# Altium schematic sheet MAXIM-ADC3.SchDoc
size B
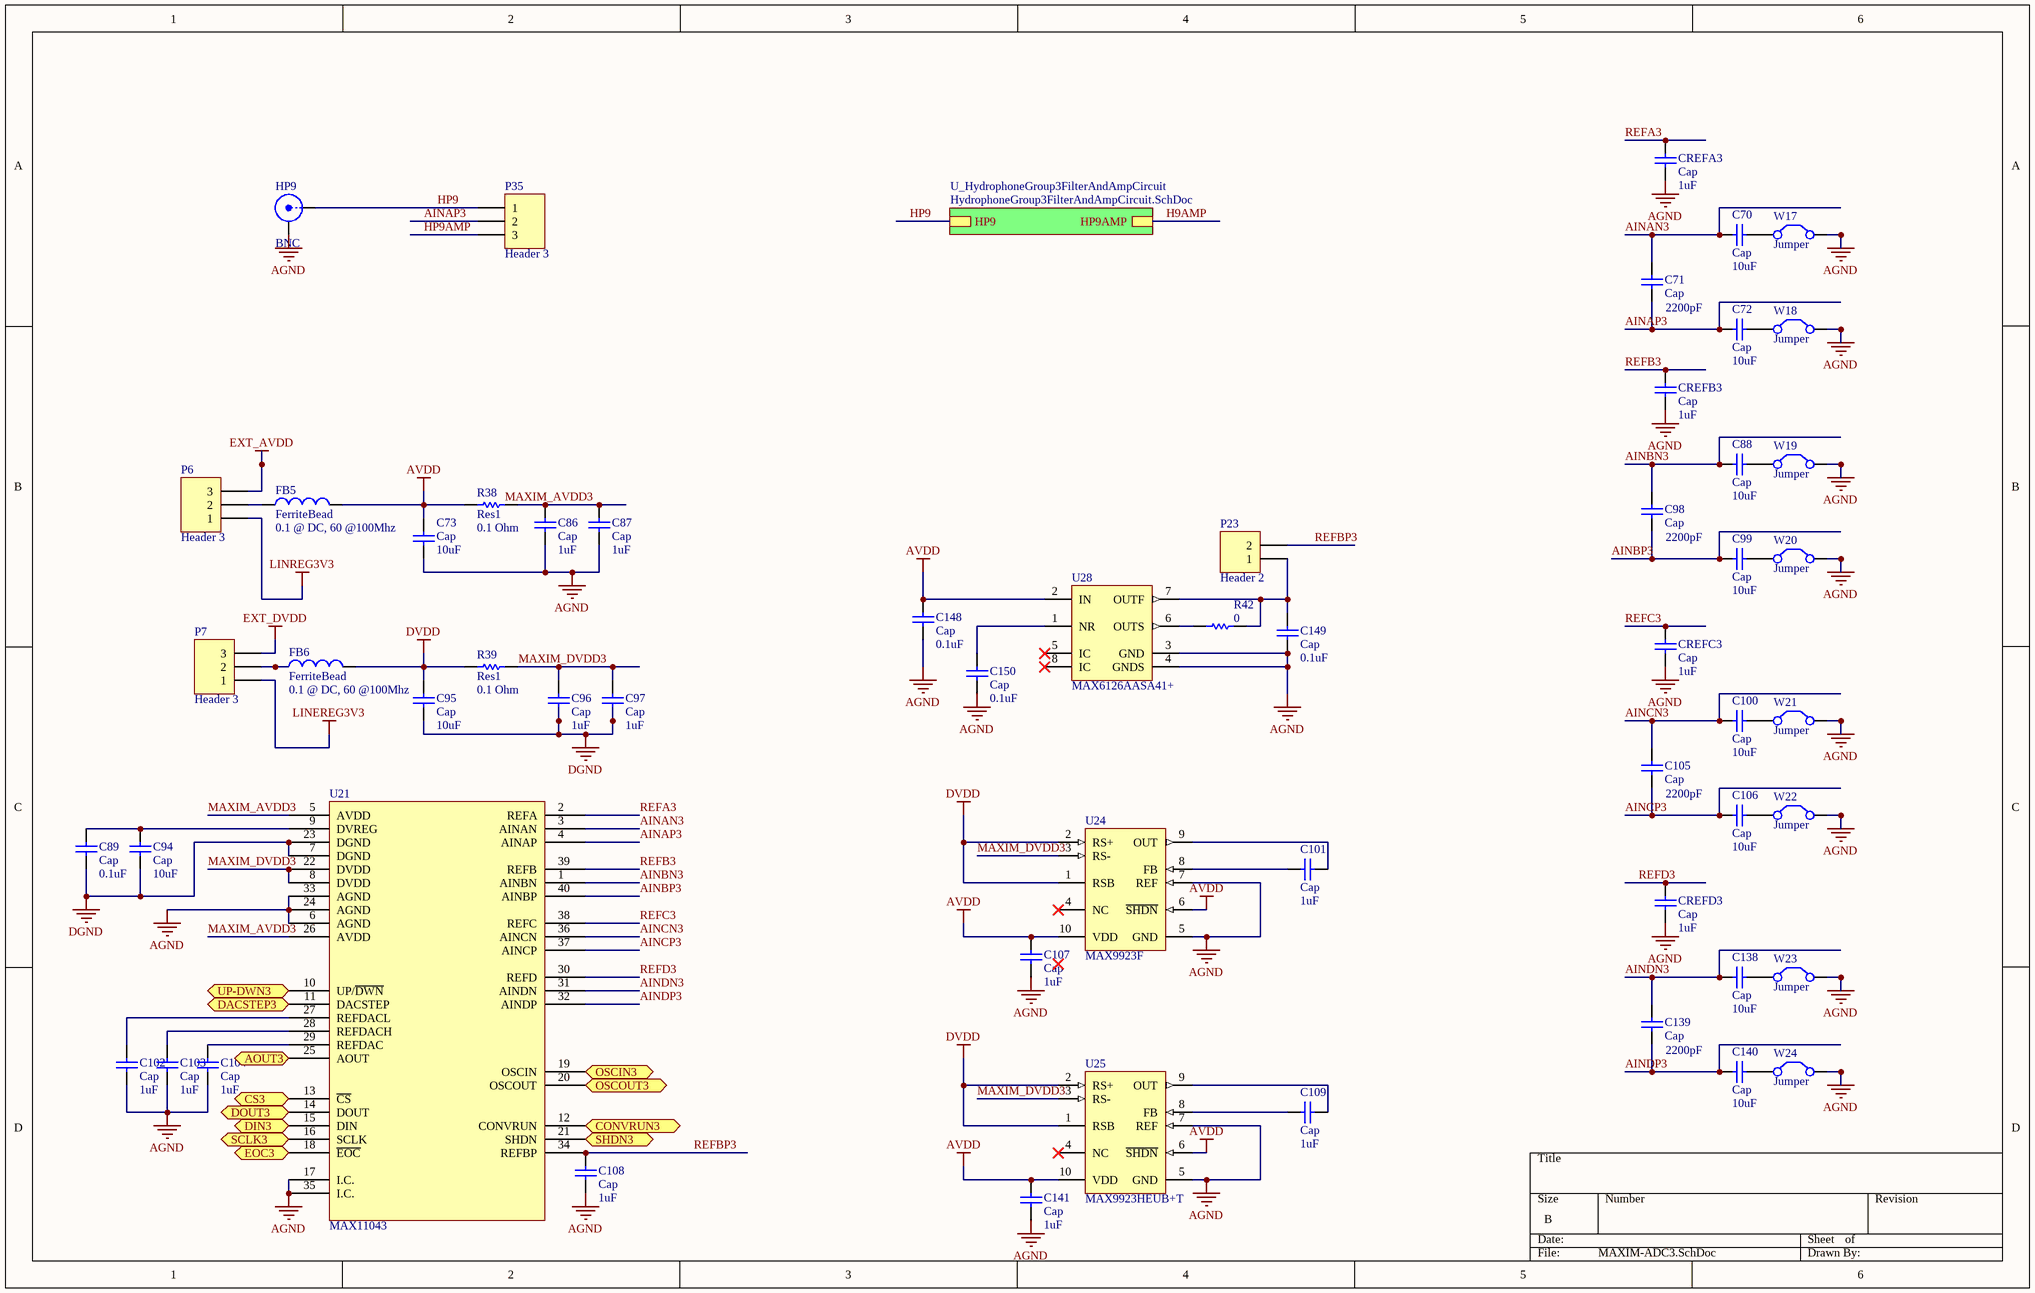
[diagram p0: MAXIM-ADC3.SchDoc]

## Parts
C70  Cap  value 10uF  [RAD-0.3]
C71  Cap  value 2200pF  [RAD-0.3]
C72  Cap  value 10uF  [RAD-0.3]
C73  Cap  value 10uF  [RAD-0.3]
C86  Cap  value 1uF  [0603]
C87  Cap  value 1uF  [RAD-0.3]
C88  Cap  value 10uF  [RAD-0.3]
C89  Cap  value 0.1uF  [RAD-0.3]
C94  Cap  value 10uF  [RAD-0.3]
C95  Cap  value 10uF  [RAD-0.3]
C96  Cap  value 1uF  [RAD-0.3]
C97  Cap  value 1uF  [RAD-0.3]
C98  Cap  value 2200pF  [RAD-0.3]
C99  Cap  value 10uF  [RAD-0.3]
C100  Cap  value 10uF  [RAD-0.3]
C101  Cap  value 1uF  [RAD-0.3]
C102  Cap  value 1uF  [RAD-0.3]
C103  Cap  value 1uF  [RAD-0.3]
C104  Cap  value 1uF  [RAD-0.3]
C105  Cap  value 2200pF  [RAD-0.3]
C106  Cap  value 10uF  [RAD-0.3]
C107  Cap  value 1uF  [RAD-0.3]
C108  Cap  value 1uF  [RAD-0.3]
C109  Cap  value 1uF  [RAD-0.3]
C138  Cap  value 10uF  [RAD-0.3]
C139  Cap  value 2200pF  [RAD-0.3]
C140  Cap  value 10uF  [RAD-0.3]
C141  Cap  value 1uF  [RAD-0.3]
C148  Cap  value 0.1uF  [RAD-0.3]
C149  Cap  value 0.1uF  [RAD-0.3]
C150  Cap  value 0.1uF  [RAD-0.3]
CREFA3  Cap  value 1uF  [RAD-0.3]
CREFB3  Cap  value 1uF  [RAD-0.3]
CREFC3  Cap  value 1uF  [RAD-0.3]
CREFD3  Cap  value 1uF  [RAD-0.3]
FB5  FerriteBead  value 0.1 @ DC, 60 @100Mhz  [0603]
FB6  FerriteBead  value 0.1 @ DC, 60 @100Mhz  [0603]
HP9  BNC  [BNC_RA CON]
P6  Header 3  [HDR1X3]
P7  Header 3  [HDR1X3]
P23  Header 2  [HDR1X2]
P35  Header 3  [HDR1X3]
R38  Res1  value 0.1 Ohm  [AXIAL-0.3]
R39  Res1  value 0.1 Ohm  [AXIAL-0.3]
R42  value 0  [AXIAL-0.3]
U21  MAX11043
U24  MAX9923F  [MAXM-U10+2_N]
U25  MAX9923HEUB+T  [MAXM-U10+2_N]
U28  MAX6126AASA41+  [MAXM-S8+4_M]
W17  Jumper  [RAD-0.2]
W18  Jumper  [RAD-0.2]
W19  Jumper  [RAD-0.2]
W20  Jumper  [RAD-0.2]
W21  Jumper  [RAD-0.2]
W22  Jumper  [RAD-0.2]
W23  Jumper  [RAD-0.2]
W24  Jumper  [RAD-0.2]

## Sub-sheets
U_HydrophoneGroup3FilterAndAmpCircuit = HydrophoneGroup3FilterAndAmpCircuit.SchDoc: HP9AMP, HP9

## Ports
AOUT3, CONVRUN3, CS3, DACSTEP3, DIN3, DOUT3, EOC3, OSCIN3, OSCOUT3, SCLK3, SHDN3, UP-DWN3

## Nets
AGND: C73.2 C86.2 C87.2 C102.1 C103.2 C104.1 C107.1 C108.2 C141.1 C148.2 C149.2 C150.2 CREFA3.1 CREFB3.1 CREFC3.1 CREFD3.1 HP9.2(Y) U21.6(AGND) U21.17(I.C.) U21.24(AGND) U21.33(AGND) U21.35(I.C.) U24.5(GND) U24.7(REF) U25.5(GND) U25.7(REF) U28.3(GND) U28.4(GNDS) W17.2(C2) W18.2(C2) W19.2(C2) W20.2(C2) W21.2(C2) W22.2(C2) W23.2(C2) W24.2(C2)
AVDD: C73.1 C107.2 C141.2 C148.1 FB5.2 R38.2 U24.6(~{SHDN}) U24.10(VDD) U25.6(~{SHDN}) U25.10(VDD) U28.2(IN)
DGND: C89.2 C94.2 C95.2 C96.2 C97.2 U21.7(DGND) U21.23(DGND)
DVDD: C95.1 FB6.2 R39.2 U24.1(RSB) U24.2(RS+) U25.1(RSB) U25.2(RS+)
EXT_AVDD: P6.3
EXT_DVDD: P7.3
LINEREG3V3: P7.1
LINREG3V3: P6.1
AINAN3: C70.2 C71.2 U21.3(AINAN)
AINAP3: C71.1 C72.2 P35.2 U21.4(AINAP)
AINBN3: C88.2 C98.2 U21.1(AINBN)
AINBP3: C98.1 C99.2 U21.40(AINBP)
AINCN3: C100.2 C105.2 U21.36(AINCN)
AINCP3: C105.1 C106.2 U21.37(AINCP)
AINDN3: C138.2 C139.2 U21.31(AINDN)
AINDP3: C139.1 C140.2 U21.32(AINDP)
AOUT3: U21.25(AOUT) ; port AOUT3
CONVRUN3: U21.12(CONVRUN) ; port CONVRUN3
CS3: U21.13(~{CS}) ; port CS3
DACSTEP3: U21.11(DACSTEP) ; port DACSTEP3
DIN3: U21.15(DIN) ; port DIN3
DOUT3: U21.14(DOUT) ; port DOUT3
EOC3: U21.18(~{EOC}) ; port EOC3
H9AMP: sheet U_HydrophoneGroup3FilterAndAmpCircuit/HP9AMP
HP9: HP9.1(X) P35.1 ; sheet U_HydrophoneGroup3FilterAndAmpCircuit/HP9
HP9AMP: P35.3
MAXIM_AVDD3: U21.5(AVDD) U21.26(AVDD)
MAXIM_DVDD3: C96.1 C97.1 R39.1 U21.8(DVDD) U21.22(DVDD) U24.3(RS-) U25.3(RS-)
OSCIN3: U21.19(OSCIN) ; port OSCIN3
OSCOUT3: U21.20(OSCOUT) ; port OSCOUT3
REFA3: CREFA3.2 U21.2(REFA)
REFB3: CREFB3.2 U21.39(REFB)
REFBP3: C108.1 P23.2 U21.34(REFBP)
REFC3: CREFC3.2 U21.38(REFC)
REFD3: CREFD3.2 U21.30(REFD)
SCLK3: U21.16(SCLK) ; port SCLK3
SHDN3: U21.21(SHDN) ; port SHDN3
UP-DWN3: U21.10(UP/~{DWN}) ; port UP-DWN3
NetC70_1: C70.1 W17.1(C1)
NetC72_1: C72.1 W18.1(C1)
NetC86_1: C86.1 C87.1 R38.1
NetC88_1: C88.1 W19.1(C1)
NetC89_1: C89.1 C94.1 U21.9(DVREG)
NetC99_1: C99.1 W20.1(C1)
NetC100_1: C100.1 W21.1(C1)
NetC101_1: C101.1 U24.8(FB)
NetC101_2: C101.2 U24.9(OUT)
NetC102_2: C102.2 U21.27(REFDACL)
NetC103_1: C103.1 U21.28(REFDACH)
NetC104_2: C104.2 U21.29(REFDAC)
NetC106_1: C106.1 W22.1(C1)
NetC109_1: C109.1 U25.8(FB)
NetC109_2: C109.2 U25.9(OUT)
NetC138_1: C138.1 W23.1(C1)
NetC140_1: C140.1 W24.1(C1)
NetC149_1: C149.1 P23.1 R42.1 U28.7(OUTF)
NetC150_1: C150.1 U28.1(NR)
NetFB5_1: FB5.1 P6.2
NetFB6_1: FB6.1 P7.2
NetR42_2: R42.2 U28.6(OUTS)

Not connected (* = marked no-connect by the designer): U24 4(NC)*; U25 4(NC)*; U28 5(IC)* 8(IC)*

## Notes on the sheet
- Labels drawn without touching a wire or pin: MAXIM_AVDD3

## Library data of the parts
C70-C73 C86-C89 C94-C109 C138-C141 C148-C150 CREFA3 CREFB3 CREFC3 CREFD3 = Cap: Capacitor; Published: 8-Jun-2000; LatestRevisionDate: 17-Jul-2002; LatestRevisionNote: Re-released for DXP Platform.; PackageReference: RAD-0.3; Publisher: Altium Limited; PackageDescription: Radial Cap, Thru-Hole; 2 Leads; 0.3 in Pin Spacing
FB5 FB6 = Inductor: Code_IEC: 1005; Published: 8-Jun-2000; LatestRevisionDate: 29-May-2009; LatestRevisionNote: IPC-7351 Footprint Added.; PackageReference: 0402-A; Publisher: Altium Limited; PackageDescription: Chip Inductor; Code_JEITA: 0402
HP9 = BNC: BNC Elbow Connector; LatestRevisionDate: 17-Jul-2002; LatestRevisionNote: Re-released for DXP Platform.; Publisher: Altium Limited
P6 P7 P35 = Header 3: Header, 3-Pin; LatestRevisionDate: 17-Jul-2002; LatestRevisionNote: Re-released for DXP Platform.; Publisher: Altium Limited
P23 = Header 2: Header, 2-Pin; LatestRevisionDate: 17-Jul-2002; LatestRevisionNote: Re-released for DXP Platform.; Publisher: Altium Limited
R38 R39 R42 = Res1: Resistor; Published: 8-Jun-2000; LatestRevisionDate: 17-Jul-2002; LatestRevisionNote: Re-released for DXP Platform.; PackageReference: AXIAL-0.3; Publisher: Altium Limited; PackageDescription: Axial Device, Thru-Hole; 2 Leads; 0.3 in Pin Spacing
U24 = CMP-0252-00092-1: Ultra-Precision, High-Side Current-Sense Amplifier with Fixed Gain, 100 V / V Gain, -40 to 85 degC, 10-Pin SOP (U10+2), Pb-Free, Tape and Reel; PartNumber: MAX9923HEUB+T; Gain: 25 V/V, 100 V/V ,250 V/V; Bi-Dir. Curr. Sense: Yes; ComponentLink3Description: Package Specification; ComponentLink2Description: Datasheet; ComponentLink1Description: Manufacturer URL; ComponentLink3URL: http://pdfserv.maximintegrated.com/package_dwgs/21-0061.PDF; PackageReference: U10+2; PackageDescription: 10-Pin Micro-MAX, Thin Shrink Small-Outline (U10+2), Body 3 x 3 mm, Pitch 0.5 mm; PackageVersion: Rev. L, 07/2008; Mounting Technology: Surface Mount; ComponentLink2URL: http://datasheets.maximintegrated.com/en/ds/MAX9922-MAX9923.pdf; ComponentLink1URL: http://www.maximintegrated.com/; Code_JEDEC: MO-187; DatasheetVersion: Rev. 1
U25 = CMP-0252-00092-1: Ultra-Precision, High-Side Current-Sense Amplifier with Fixed Gain, 100 V / V Gain, -40 to 85 degC, 10-Pin SOP (U10+2), Pb-Free, Tape and Reel; Gain: 25 V/V, 100 V/V ,250 V/V; Bi-Dir. Curr. Sense: Yes; PartNumber: MAX9923HEUB+T; ComponentLink3Description: Package Specification; ComponentLink2Description: Datasheet; ComponentLink1Description: Manufacturer URL; ComponentLink3URL: http://pdfserv.maximintegrated.com/package_dwgs/21-0061.PDF; PackageReference: U10+2; PackageDescription: 10-Pin Micro-MAX, Thin Shrink Small-Outline (U10+2), Body 3 x 3 mm, Pitch 0.5 mm; PackageVersion: Rev. L, 07/2008; Mounting Technology: Surface Mount; ComponentLink2URL: http://datasheets.maximintegrated.com/en/ds/MAX9922-MAX9923.pdf; ComponentLink1URL: http://www.maximintegrated.com/; Code_JEDEC: MO-187; DatasheetVersion: Rev. 1
U28 = CMP-0977-00016-1: Ultra-High-Precision, Ultra-Low-Noise, Series Voltage Reference, 4.096 V, -40 to 125 degC, 8-Pin SOIC (S8+4), RoHS, Tube; Manufacturer: Maxim; Output Voltage Accuracy: 0.02% Max.; Line Regulation: 60 uV/V Max.; VOUT: 4.096 V; Dropout Voltage@10 mA: 0.1 V Typ.; VIN: 4.3 to 12.6 V; Operating Temperature: -40 to 125 degC; ComponentLink3URL: http://pdfserv.maximintegrated.com/package_dwgs/21-0041.PDF; PartNumber: MAX6126AASA41+; RoHS: TRUE; ComponentLink3Description: Package Specification; ComponentLink1URL: http://www.maximintegrated.com/; Mounting Technology: Surface Mount; Packing: Tube; DatasheetVersion: Rev. 6; ComponentLink1Description: Manufacturer URL; ComponentLink2URL: http://datasheets.maximintegrated.com/en/ds/MAX6126.pdf; PackageDescription: 8-Pin Small Outline Integrated Circuit Package, Body 4.9 x 3.9 mm, Pitch 1.27 mm; ComponentLink2Description: Datasheet; PackageVersion: Rev. E
W17-W24 = Jumper: Jumper Wire; Published: 24-Mar-1999; LatestRevisionDate: 17-Jul-2002; LatestRevisionNote: Re-released for DXP Platform.; PackageReference: RAD-0.2; Publisher: Altium Limited; PackageDescription: Radial Cap, Thru-Hole; 2 Leads; 0.2 in Pin Spacing